# EAGLE schematic Encoder Connector (EAGLE 8.3.2)
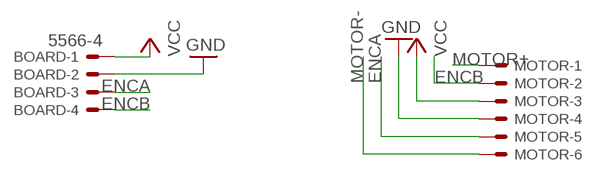
[diagram p0: schematic, sheet 1]

## Parts
BOARD  5566-4  [5566-4]
MOTOR  22-23-2061  [22-23-2061]

## Nets
ENCA: BOARD.3 MOTOR.5
ENCB: BOARD.4 MOTOR.2
GND: BOARD.2 MOTOR.4
MOTOR+: MOTOR.1
MOTOR-: MOTOR.6
VCC: BOARD.1 MOTOR.3

## Library data of the parts
BOARD = con-molex:5566-4: Mini FIT connector 4 pol Source: http://www.molex.com; OC_FARNELL: unknown; OC_NEWARK: unknown
MOTOR = con-molex:22-23-2061: .100" (2.54mm) Center Header - 6 Pin; MF: MOLEX; MPN: 22-23-2061; OC_FARNELL: 1462922; OC_NEWARK: 27C1933